# EAGLE design 16F88_FT232RL (EAGLE 4.16)
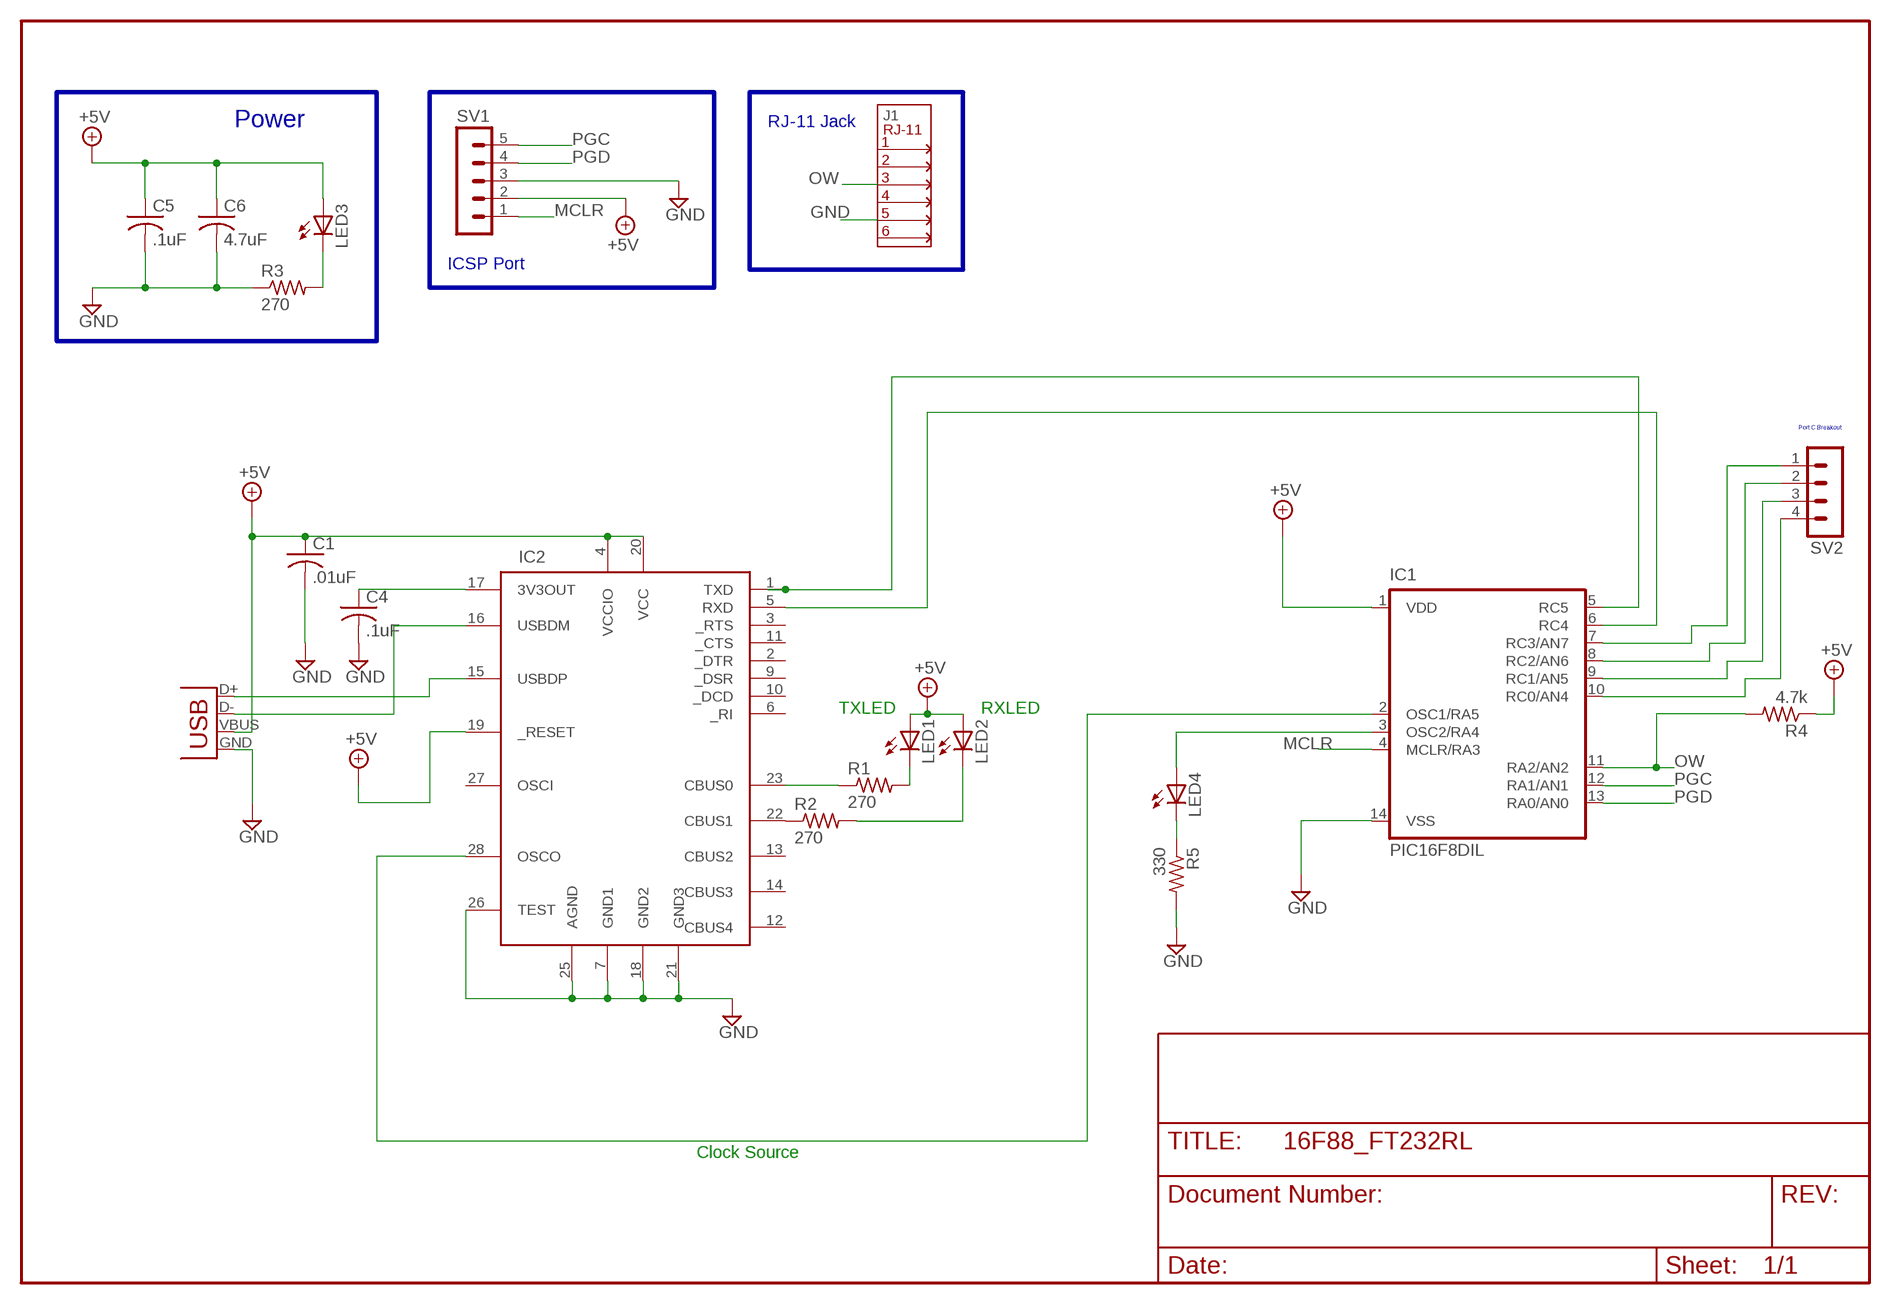
[diagram p0: schematic, sheet 1]

## Parts
C1  .01uF  C-USC1206  [C1206]
C4  .1uF  C-USC1206  [C1206]
C5  .1uF  C-USC1206  [C1206]
C6  4.7uF  C-USC1206  [C1206]
IC1  PIC16F8DIL  [DIL14]
IC2  FT232RL  [SSOP28DB]
J1  CONN-RJ11  [CONN-RJ11]
LED1  LED3MM  [LED3MM]
LED2  LED3MM  [LED3MM]
LED3  LED3MM  [LED3MM]
LED4  LEDCHIPLED_1206  [CHIPLED_1206]
R1  270  R-US_R1206  [R1206]
R2  270  R-US_R1206  [R1206]
R3  270  R-US_R1206  [R1206]
R4  4.7k  R-US_R1206  [R1206]
R5  330  R-US_R1206  [R1206]
SV1  MA05-1  [MA05-1]
SV2  MA04-1  [MA04-1]
X1  USBMINIB  [USB-MINIB]

## Nets
+5V: C1.1 C5.1 C6.1 IC1.1(VDD) IC2.4(VCCIO) IC2.19(_RESET) IC2.20(VCC) LED1.A LED2.A LED3.A R4.1 SV1.2 X1.VBUS
GND: C1.2 C4.2 C5.2 C6.2 IC1.14(VSS) IC2.7(GND1) IC2.18(GND2) IC2.21(GND3) IC2.25(AGND) IC2.26(TEST) J1.5 R3.1 R5.2 SV1.3 X1.GND
MCLR: IC1.4(MCLR/RA3) SV1.1
N$1: IC2.15(USBDP) X1.D+
N$2: IC2.16(USBDM) X1.D-
N$3: C4.1 IC2.17(3V3OUT)
N$4: LED1.K(C) R1.2
N$5: LED2.K(C) R2.2
N$6: IC2.23(CBUS0) R1.1
N$7: IC2.22(CBUS1) R2.1
N$8: LED3.K(C) R3.2
N$9: IC1.2(OSC1/RA5) IC2.28(OSCO)
N$10: IC1.5(RC5) IC2.1(TXD)
N$11: IC1.6(RC4) IC2.5(RXD)
N$12: IC1.10(RC0/AN4) SV2.4
N$13: IC1.9(RC1/AN5) SV2.3
N$14: IC1.8(RC2/AN6) SV2.2
N$15: IC1.7(RC3/AN7) SV2.1
N$17: IC1.3(OSC2/RA4) LED4.A
N$18: LED4.C R5.1
OW: IC1.11(RA2/AN2) J1.3 R4.2
PGC: IC1.12(RA1/AN1) SV1.5
PGD: IC1.13(RA0/AN0) SV1.4
Unconnected: IC2.2(_DTR) IC2.3(_RTS) IC2.6(_RI) IC2.9(_DSR) IC2.10(_DCD) IC2.11(_CTS) IC2.12(CBUS4) IC2.13(CBUS2) IC2.14(CBUS3) IC2.27(OSCI) J1.1 J1.2 J1.4 J1.6

## Buses
B$2
B$3
B$1

## Notes on the sheet
- Power | RJ-11 Jack
- ICSP Port
- Port C Breakout
- TXLED | RXLED
- Clock Source

## Library data of the parts
C1 C4-C6 = rcl:C-US: CAPACITOR, American symbol
IC1 = pic16f6xx_14pin:PIC16F8*: MICROCONTROLLER 14-Pin, 8-Bit PIC16F8X Family - CMOS Flash Pin Compatible : 16F630, 16F676, 16F684, 16F688 Keywords: PIC16F630, PIC16F676, PIC16F684, PIC16F688
IC2 = SparkFunEagle-6-6-07:FT232RL: USB UART FT232RL 4th Generation USB UART (USB <-> Serial) Controller. Spark Fun Electronics SKU : COM-00650
J1 = QuantumOptics:CONN-RJ11: RJ-11 "phone" jack.
LED1-LED4 = led:LED: LED OSRAM: - CHIPLED LG R971, LG N971, LY N971, LG Q971, LY Q971, LO R971, LY R971 LH N974, LH R974 LS Q976, LO Q976, LY Q976 LO Q996 - Hyper CHIPLED LW Q18S LB Q993, LB Q99A, LB R99A - SideLED LS A670, LO A670, LY A670, LG A670, LP A670 LB A673, LV A673, LT A673, LW A673 LH A674 LY A675 LS A676, LA A676, LO A676, LY A676, LW A676 LS A679, LY A679, LG A679 - Hyper Micro SIDELED® LS Y876, LA Y876, LO Y876, LY Y876 LT Y87S - SmartLED LW L88C, LW L88S LB L89C, LB L89S, LG L890 LS L89K, LO L89K, LY L89K LS L896, LA L896, LO L896, LY L896 - TOPLED LS T670, LO T670, LY T670, LG T670, LP T670 LSG T670, LSP T670, LSY T670, LOP T670, LYG T670 LG T671, LOG T671, LSG T671 LB T673, LV T673, LT T673, LW T673 LH T674 LS T676, LA T676, LO T676, LY T676, LB T676, LH T676, LSB T676, LW T676 LB T67C, LV T67C, LT T67C, LS T67K, LO T67K, LY T67K, LW E67C LS E67B, LA E67B, LO E67B, LY E67B, LB E67C, LV E67C, LT E67C LW T67C LS T679, LY T679, LG T679 LS T770, LO T770, LY T770, LG T770, LP T770 LB T773, LV T773, LT T773, LW T773 LH T774 LS E675, LA E675, LY E675, LS T675 LS T776, LA T776, LO T776, LY T776, LB T776 LHGB T686 LT T68C, LB T68C - Hyper Mini TOPLED® LB M676 - Mini TOPLED Santana® LG M470 LS M47K, LO M47K, LY M47K Source: http://www.osram.convergy.de/
R1-R5 = rcl:R-US_: RESISTOR, American symbol
SV1 = con-lstb:MA05-1: PIN HEADER
SV2 = con-lstb:MA04-1: PIN HEADER
X1 = SparkFunEagle-6-6-07:USB: USB Connectors USB-B-PTH is fully proven SKU : PRT-00139 USB-miniB is fully proven SKU : PRT-00587 USB-A-H is throughly reviewed, but untested. Spark Fun Electronics SKU : PRT-00437 USB-B-SMT is throughly reviewed, but untested. Needs silkscreen touching up. USB-A-S has not been used/tested USB-MB-H has not been used/tested

## Board
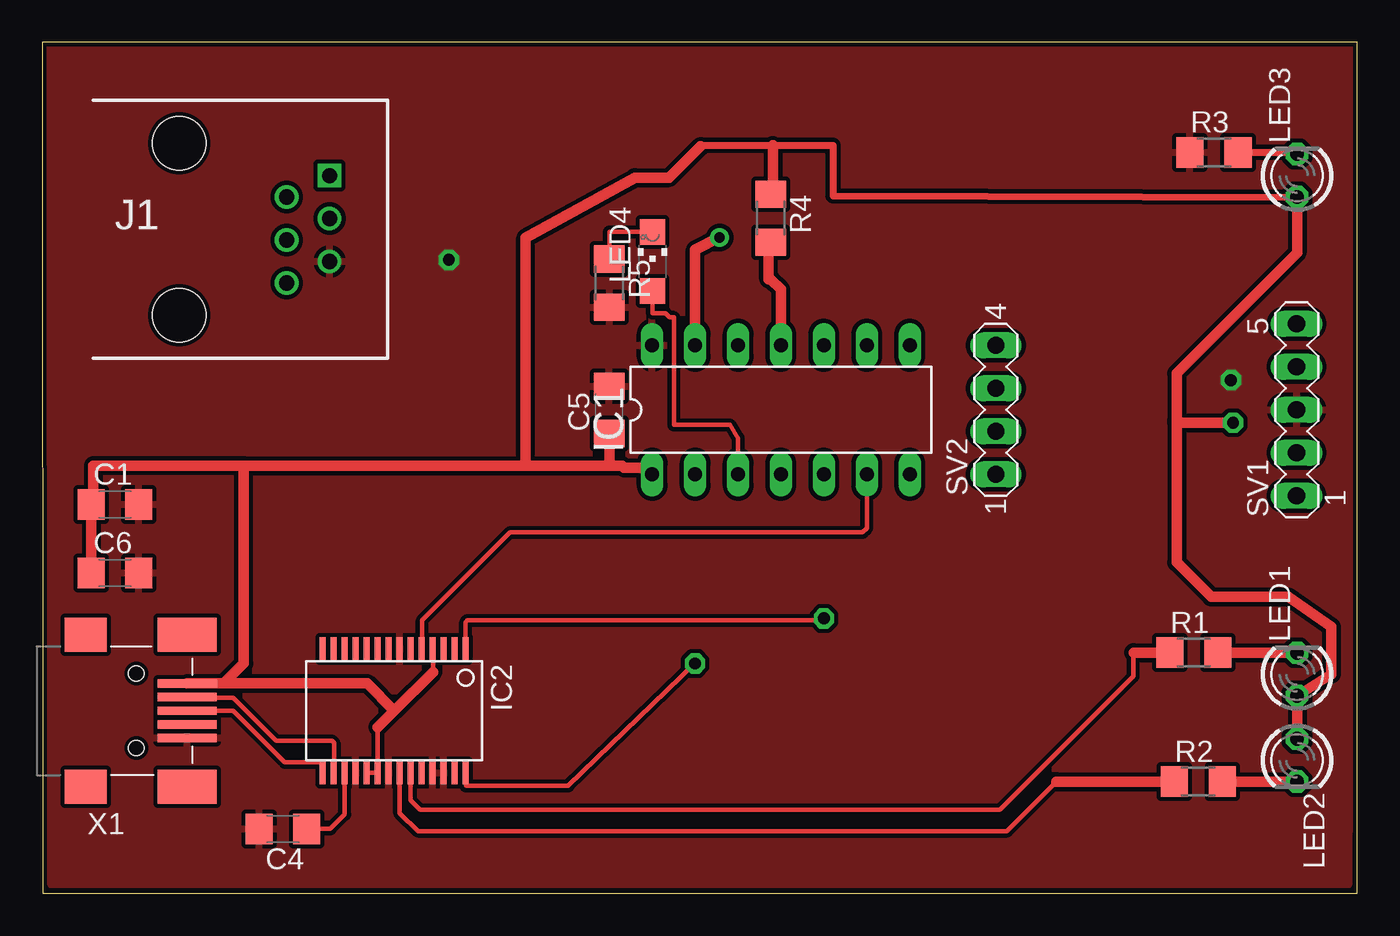
[diagram p1: board, top side]
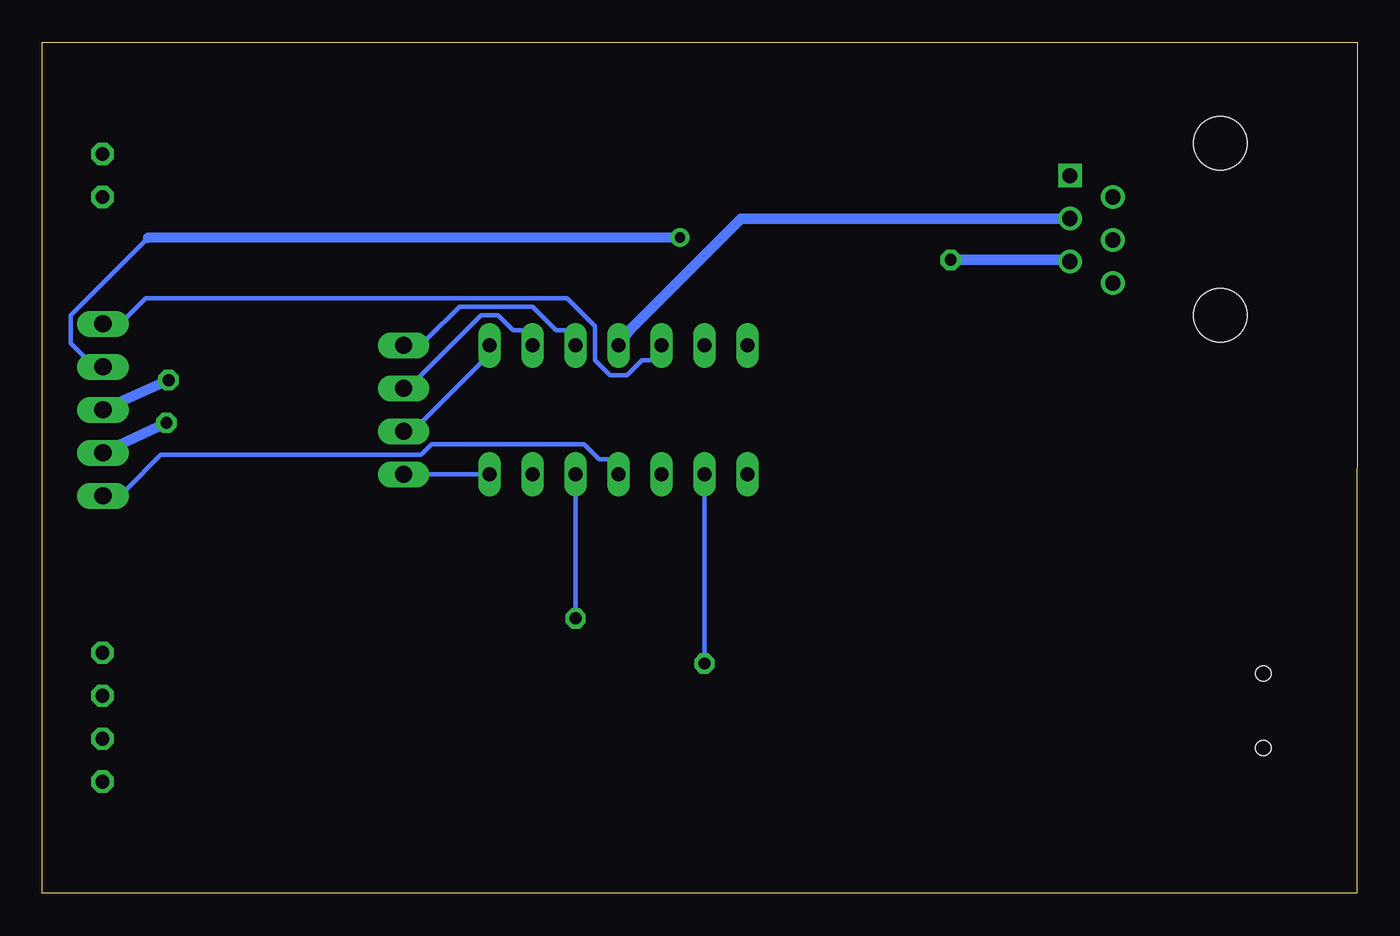
[diagram p2: board, bottom side, seen from below]

Size 77.72 x 50.29 mm. Coordinates in mm from the lower left corner, seen from the top.
Outline: 0.01,0.01 77.72,0 77.72,50.29 0,50.29 0.01,0.01
Copper layers (1*16): Top 0.035mm / dielectric 1.5mm / Bottom 0.035mm
Design rules "LPKF": minimum track width 10mil, minimum drill 24mil, track to track 10mil, track to pad 10mil, pad to pad 10mil, via to via 10mil, smd to smd 10mil, copper to edge 10mil, drill to drill 10mil, minimum pad ring 10mil, minimum via ring 10mil, stop-mask expansion 4mil, vias tented up to drill 0mil, thermal gap 10mil

### Footprints (pad centres in the part's own frame; a part is rotated, then mirrored left to right if it is on the bottom)
C1206 = smd 1.6 x 1.8: 1 -1.4,0; 2 1.4,0
DIL14 = drill 0.813 long: 1 -10.16,-3.81; 2 -7.62,-3.81; 3 -5.08,-3.81; 4 -2.54,-3.81; 5 0,-3.81; 6 2.54,-3.81; 7 5.08,-3.81; 8 5.08,3.81; 9 2.54,3.81; 10 0,3.81; 11 -2.54,3.81; 12 -5.08,3.81; 13 -7.62,3.81; 14 -10.16,3.81
SSOP28DB = smd 0.348 x 1.397: 1 -4.225,-3.656; 2 -3.575,-3.656; 3 -2.925,-3.656; 4 -2.275,-3.656; 5 -1.625,-3.656; 6 -0.975,-3.656; 7 -0.325,-3.656; 8 0.325,-3.656; 9 0.975,-3.656; 10 1.625,-3.656; 11 2.275,-3.656; 12 2.925,-3.656; 13 3.575,-3.656; 14 4.225,-3.656; 15 4.225,3.656; 16 3.575,3.656; 17 2.925,3.656; 18 2.275,3.656; 19 1.625,3.656; 20 0.975,3.656; 21 0.325,3.656; 22 -0.325,3.656; 23 -0.975,3.656; 24 -1.625,3.656; 25 -2.275,3.656; 26 -2.925,3.656; 27 -3.575,3.656; 28 -4.225,3.656
CONN-RJ11 = drill 0.889 square: 1 1.27,3.175 | drill 0.889 round: 2 -1.27,1.905; 3 1.27,0.635; 4 -1.27,-0.635; 5 1.27,-1.905; 6 -1.27,-3.175 | hole 3.175: -7.62,5.08; -7.62,-5.08
LED3MM = drill 0.813 octagon: A -1.27,0; K 1.27,0
CHIPLED_1206 = smd 1.5 x 1.5: A 0,-1.75; C 0,1.75
R1206 = smd 1.6 x 1.803: 1 -1.422,0; 2 1.422,0
MA05-1 = drill 1.016 long: 1 -5.08,0; 2 -2.54,0; 3 0,0; 4 2.54,0; 5 5.08,0
MA04-1 = drill 1.016 long: 1 -3.81,0; 2 -1.27,0; 3 1.27,0; 4 3.81,0
USB-MINIB = smd 2.5 x 2: 1 -3,-4.5; 2 -3,4.5 | smd 3.5 x 2: 3 3,-4.5; 4 3,4.5 | smd 3.5 x 0.5: D+ 3,0; D- 3,0.8; GND 3,-1.6; ID 3,-0.8; VBUS 3.01,1.61 | hole 0.9: 0,2.2; 0,-2.2

### Placement (x,y rotation side)
C1  4.29,22.99 0 top
C4  14.22,3.81 180 top
C5  33.5,28.57 90 top
C6  4.29,18.93 0 top
IC1  46.2,28.57 0 top
IC2  20.8,10.79 180 top
J1  15.71,39.25 0 top
LED1  74.17,12.95 90 top
LED2  74.17,7.87 270 top
LED3  74.17,42.42 90 top
LED4  36.07,37.34 0 top
R1  68.07,14.22 0 top
R2  68.33,6.6 0 top
R3  69.26,43.8 0 top
R4  43.05,39.9 270 top
R5  33.53,36.07 270 top
SV1  74.14,28.57 90 top
SV2  56.36,28.57 90 top
X1  5.56,10.79 0 top

### Tracks (layer width: path | path; a pad name or v marks a point on that pad's centre or on a via)
+5V  (via drill 0.7)
  Top 0.254: 34.27,25.27 34.39,25.15 | 3.02,22.99 C1.1 2.77,22.99 2.89,22.86 | 19.83,9.82 IC2.20 19.81,7.14 IC2.19 | IC2.4 23.08,14.85 23.09,14.86 23.09,13.08 | X1.VBUS 10.73,12.4
  Top 0.406: LED3.A 46.74,41.21 46.74,44.2 43.18,44.2 38.86,44.2 38.91,44.15
  Top 0.61: 34.39,25.15 35.41,25.15 IC1.1 | 11.91,25.27 3.02,25.27 3.02,22.99 | 11.91,25.27 28.57,25.27 | 28.57,25.27 34.27,25.27 33.53,25.27 33.53,27.18 | 28.57,25.27 28.57,38.73 35.03,42.29 37.06,42.29 38.91,44.15 | 20.8,10.79 19.83,9.82 | 20.8,10.79 23.09,13.08 | X1.VBUS 19.19,12.4 20.8,10.79 | 10.73,12.4 11.91,13.59 11.91,25.27 | 2.89,22.86 C6.1 | LED3.A 74.17,37.85 67.06,30.73 67.06,27.94 | 67.06,27.94 67.06,19.56 69.09,17.53 73.66,17.53 76.2,15.75 76.2,12.95 LED1.A LED2.A | v70.38,27.81 67.06,27.81 67.06,27.94 | 33.53,27.18 33.53,27.43 | 33.53,27.18 C5.1 | R4.1 43.18,41.33 43.18,44.2
  Bottom 0.61: v70.38,27.81 SV1.2
GND  (via drill 0.7)
  Bottom 0.61: v24.03,37.44 16.94,37.44 16.89,37.39 | 70.23,30.35 SV1.3
  other vias: 70.26,30.33
  pour Top: 0.48,50.06 77.47,50.04 77.22,0.51 0.51,0.51
MCLR
  Bottom 0.254: IC1.4 44.3,25.65 44.81,25.65 45.7,26.54 54.71,26.54 55.35,25.91 70.71,25.91 72.75,23.88 SV1.1
N$1
  Top 0.254: IC2.15 16.48,7.75 14.33,7.75 11.28,10.79 X1.D+
N$2
  Top 0.254: IC2.16 17.25,7.75 17.25,8.89 17.12,9.02 13.82,9.02 11.28,11.56 10.13,11.56 X1.D-
N$3
  Top 0.254: IC2.17 17.88,6.48 17.88,4.67 17.02,3.81 C4.1 15.49,3.81
N$4
  Top 0.61: R1.2 LED1.K
N$5
  Top 0.61: LED2.K 74.17,6.35 73.91,6.6 R2.2
N$6
  Top 0.254: IC2.23 21.78,5.5 22.33,4.95 56.62,4.95 64.49,12.83 64.49,14.2 64.52,14.22 | R1.1 66.8,14.22
  Top 0.61: 64.52,14.22 R1.1
N$7
  Top 0.254: IC2.22 21.13,6.91 21.13,6.88 21.13,4.72 22.2,3.68 57.02,3.68 59.94,6.6 | R2.1 67.06,6.6
  Top 0.61: 59.94,6.6 R2.1
N$8
  Top 0.406: LED3.K 74.17,43.75 74.17,43.8 R3.2
N$9  (via drill 0.7)
  Top 0.254: v38.58,13.59 31.09,6.35 25.04,6.35 25.04,7.14 IC2.28
  Bottom 0.254: IC1.2 38.71,24.77 38.58,24.64 v38.58,13.59
N$10  (via drill 0.7)
  Top 0.254: IC2.1 25.03,16.04 25.12,16.13 46.08,16.13 v46.2,16.26
  Bottom 0.254: IC1.5 46.08,24.77 46.2,24.64 v46.2,16.26
N$11
  Top 0.254: IC2.5 22.45,15.11 22.45,16.13 27.66,21.34 48.49,21.34 48.74,21.59 IC1.6
N$12
  Bottom 0.254: IC1.10 46.84,33.27 47.35,33.27 48.74,34.67 53.06,34.67 54.97,32.77 SV2.4
N$13
  Bottom 0.254: IC1.9 49.38,33.27 49.89,33.27 50.77,34.16 51.79,34.16 55.47,30.48 SV2.3
N$14
  Bottom 0.254: IC1.8 51.79,31.37 55.22,27.94 SV2.2
N$15
  Bottom 0.254: IC1.7 SV2.1
N$17
  Top 0.254: IC1.3 41.12,26.9 40.64,27.69 37.34,27.69 37.34,34.04 37.08,34.04 36.83,34.29 36.07,34.29 LED4.A
N$18
  Top 0.254: 33.53,37.08 R5.1 33.53,39.09 LED4.C
OW
  Top 0.61: IC1.11 43.66,35.69 43.05,36.3 42.93,36.3 42.93,38.48 | 42.93,38.48 42.93,38.61 | 42.93,38.48 R4.2
  Bottom 0.61: J1.3 16.87,39.88 36.42,39.88 43.03,33.27 IC1.11
PGC
  Bottom 0.254: IC1.12 41.76,31.5 42.27,31.5 43.16,30.61 44.17,30.61 45.06,31.5 45.06,33.53 46.71,35.18 71.6,35.18 72.75,34.04 SV1.5
PGD  (via drill 0.61)
  Top 0.61: v40.03,38.76 38.58,38.02 IC1.13
  Bottom 0.254: 71.48,38.73 76.05,34.16 76.05,32.51 75.29,31.75 SV1.4
  Bottom 0.61: v40.03,38.76 71.48,38.73

### Text on the board
tText: Pyro Logger 2007 | Pwr | Souly Solar | MCLR